# Altium schematic sheet DecadeBox_1.SchDoc: RESISTOR DECADE BOX
size Letter; SheetNumber: 1; SheetTotal: 2
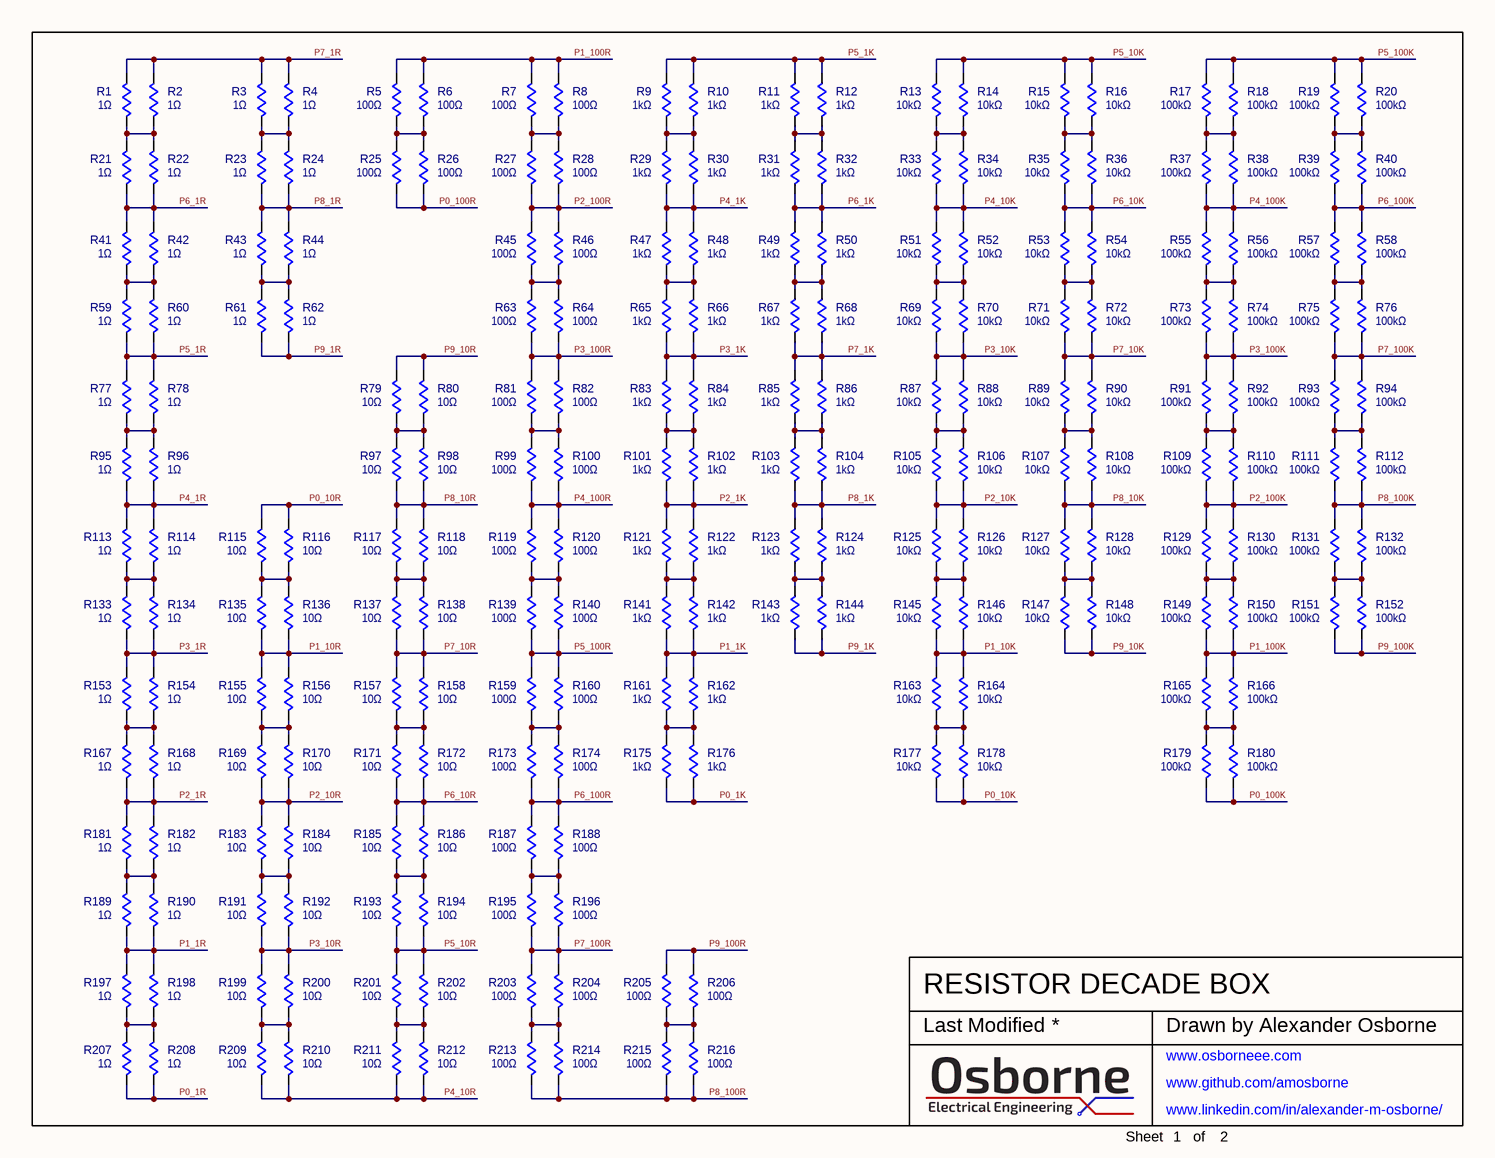
[diagram p0: DecadeBox_1.SchDoc]

## Parts
R1  value 1Ω  [MRS25]  (hidden comment: BC3963CT-ND)
R2  value 1Ω  [MRS25]  (hidden comment: BC3963CT-ND)
R3  value 1Ω  [MRS25]  (hidden comment: BC3963CT-ND)
R4  value 1Ω  [MRS25]  (hidden comment: BC3963CT-ND)
R5  value 100Ω  [MRS25]  (hidden comment: PPC100ZCT-ND)
R6  value 100Ω  [MRS25]  (hidden comment: PPC100ZCT-ND)
R7  value 100Ω  [MRS25]  (hidden comment: PPC100ZCT-ND)
R8  value 100Ω  [MRS25]  (hidden comment: PPC100ZCT-ND)
R9  value 1kΩ  [MRS25]  (hidden comment: PPC1.00KZCT-ND)
R10  value 1kΩ  [MRS25]  (hidden comment: PPC1.00KZCT-ND)
R11  value 1kΩ  [MRS25]  (hidden comment: PPC1.00KZCT-ND)
R12  value 1kΩ  [MRS25]  (hidden comment: PPC1.00KZCT-ND)
R13  value 10kΩ  [MRS25]  (hidden comment: BC3955CT-ND)
R14  value 10kΩ  [MRS25]  (hidden comment: BC3955CT-ND)
R15  value 10kΩ  [MRS25]  (hidden comment: BC3955CT-ND)
R16  value 10kΩ  [MRS25]  (hidden comment: BC3955CT-ND)
R17  value 100kΩ  [MRS25]  (hidden comment: BC3327CT-ND)
R18  value 100kΩ  [MRS25]  (hidden comment: BC3327CT-ND)
R19  value 100kΩ  [MRS25]  (hidden comment: BC3327CT-ND)
R20  value 100kΩ  [MRS25]  (hidden comment: BC3327CT-ND)
R21  value 1Ω  [MRS25]  (hidden comment: BC3963CT-ND)
R22  value 1Ω  [MRS25]  (hidden comment: BC3963CT-ND)
R23  value 1Ω  [MRS25]  (hidden comment: BC3963CT-ND)
R24  value 1Ω  [MRS25]  (hidden comment: BC3963CT-ND)
R25  value 100Ω  [MRS25]  (hidden comment: PPC100ZCT-ND)
R26  value 100Ω  [MRS25]  (hidden comment: PPC100ZCT-ND)
R27  value 100Ω  [MRS25]  (hidden comment: PPC100ZCT-ND)
R28  value 100Ω  [MRS25]  (hidden comment: PPC100ZCT-ND)
R29  value 1kΩ  [MRS25]  (hidden comment: PPC1.00KZCT-ND)
R30  value 1kΩ  [MRS25]  (hidden comment: PPC1.00KZCT-ND)
R31  value 1kΩ  [MRS25]  (hidden comment: PPC1.00KZCT-ND)
R32  value 1kΩ  [MRS25]  (hidden comment: PPC1.00KZCT-ND)
R33  value 10kΩ  [MRS25]  (hidden comment: BC3955CT-ND)
R34  value 10kΩ  [MRS25]  (hidden comment: BC3955CT-ND)
R35  value 10kΩ  [MRS25]  (hidden comment: BC3955CT-ND)
R36  value 10kΩ  [MRS25]  (hidden comment: BC3955CT-ND)
R37  value 100kΩ  [MRS25]  (hidden comment: BC3327CT-ND)
R38  value 100kΩ  [MRS25]  (hidden comment: BC3327CT-ND)
R39  value 100kΩ  [MRS25]  (hidden comment: BC3327CT-ND)
R40  value 100kΩ  [MRS25]  (hidden comment: BC3327CT-ND)
R41  value 1Ω  [MRS25]  (hidden comment: BC3963CT-ND)
R42  value 1Ω  [MRS25]  (hidden comment: BC3963CT-ND)
R43  value 1Ω  [MRS25]  (hidden comment: BC3963CT-ND)
R44  value 1Ω  [MRS25]  (hidden comment: BC3963CT-ND)
R45  value 100Ω  [MRS25]  (hidden comment: PPC100ZCT-ND)
R46  value 100Ω  [MRS25]  (hidden comment: PPC100ZCT-ND)
R47  value 1kΩ  [MRS25]  (hidden comment: PPC1.00KZCT-ND)
R48  value 1kΩ  [MRS25]  (hidden comment: PPC1.00KZCT-ND)
R49  value 1kΩ  [MRS25]  (hidden comment: PPC1.00KZCT-ND)
R50  value 1kΩ  [MRS25]  (hidden comment: PPC1.00KZCT-ND)
R51  value 10kΩ  [MRS25]  (hidden comment: BC3955CT-ND)
R52  value 10kΩ  [MRS25]  (hidden comment: BC3955CT-ND)
R53  value 10kΩ  [MRS25]  (hidden comment: BC3955CT-ND)
R54  value 10kΩ  [MRS25]  (hidden comment: BC3955CT-ND)
R55  value 100kΩ  [MRS25]  (hidden comment: BC3327CT-ND)
R56  value 100kΩ  [MRS25]  (hidden comment: BC3327CT-ND)
R57  value 100kΩ  [MRS25]  (hidden comment: BC3327CT-ND)
R58  value 100kΩ  [MRS25]  (hidden comment: BC3327CT-ND)
R59  value 1Ω  [MRS25]  (hidden comment: BC3963CT-ND)
R60  value 1Ω  [MRS25]  (hidden comment: BC3963CT-ND)
R61  value 1Ω  [MRS25]  (hidden comment: BC3963CT-ND)
R62  value 1Ω  [MRS25]  (hidden comment: BC3963CT-ND)
R63  value 100Ω  [MRS25]  (hidden comment: PPC100ZCT-ND)
R64  value 100Ω  [MRS25]  (hidden comment: PPC100ZCT-ND)
R65  value 1kΩ  [MRS25]  (hidden comment: PPC1.00KZCT-ND)
R66  value 1kΩ  [MRS25]  (hidden comment: PPC1.00KZCT-ND)
R67  value 1kΩ  [MRS25]  (hidden comment: PPC1.00KZCT-ND)
R68  value 1kΩ  [MRS25]  (hidden comment: PPC1.00KZCT-ND)
R69  value 10kΩ  [MRS25]  (hidden comment: BC3955CT-ND)
R70  value 10kΩ  [MRS25]  (hidden comment: BC3955CT-ND)
R71  value 10kΩ  [MRS25]  (hidden comment: BC3955CT-ND)
R72  value 10kΩ  [MRS25]  (hidden comment: BC3955CT-ND)
R73  value 100kΩ  [MRS25]  (hidden comment: BC3327CT-ND)
R74  value 100kΩ  [MRS25]  (hidden comment: BC3327CT-ND)
R75  value 100kΩ  [MRS25]  (hidden comment: BC3327CT-ND)
R76  value 100kΩ  [MRS25]  (hidden comment: BC3327CT-ND)
R77  value 1Ω  [MRS25]  (hidden comment: BC3963CT-ND)
R78  value 1Ω  [MRS25]  (hidden comment: BC3963CT-ND)
R79  value 10Ω  [MRS25]  (hidden comment: PPC10.0ZCT-ND)
R80  value 10Ω  [MRS25]  (hidden comment: PPC10.0ZCT-ND)
R81  value 100Ω  [MRS25]  (hidden comment: PPC100ZCT-ND)
R82  value 100Ω  [MRS25]  (hidden comment: PPC100ZCT-ND)
R83  value 1kΩ  [MRS25]  (hidden comment: PPC1.00KZCT-ND)
R84  value 1kΩ  [MRS25]  (hidden comment: PPC1.00KZCT-ND)
R85  value 1kΩ  [MRS25]  (hidden comment: PPC1.00KZCT-ND)
R86  value 1kΩ  [MRS25]  (hidden comment: PPC1.00KZCT-ND)
R87  value 10kΩ  [MRS25]  (hidden comment: BC3955CT-ND)
R88  value 10kΩ  [MRS25]  (hidden comment: BC3955CT-ND)
R89  value 10kΩ  [MRS25]  (hidden comment: BC3955CT-ND)
R90  value 10kΩ  [MRS25]  (hidden comment: BC3955CT-ND)
R91  value 100kΩ  [MRS25]  (hidden comment: BC3327CT-ND)
R92  value 100kΩ  [MRS25]  (hidden comment: BC3327CT-ND)
R93  value 100kΩ  [MRS25]  (hidden comment: BC3327CT-ND)
R94  value 100kΩ  [MRS25]  (hidden comment: BC3327CT-ND)
R95  value 1Ω  [MRS25]  (hidden comment: BC3963CT-ND)
R96  value 1Ω  [MRS25]  (hidden comment: BC3963CT-ND)
R97  value 10Ω  [MRS25]  (hidden comment: PPC10.0ZCT-ND)
R98  value 10Ω  [MRS25]  (hidden comment: PPC10.0ZCT-ND)
R99  value 100Ω  [MRS25]  (hidden comment: PPC100ZCT-ND)
R100  value 100Ω  [MRS25]  (hidden comment: PPC100ZCT-ND)
R101  value 1kΩ  [MRS25]  (hidden comment: PPC1.00KZCT-ND)
R102  value 1kΩ  [MRS25]  (hidden comment: PPC1.00KZCT-ND)
R103  value 1kΩ  [MRS25]  (hidden comment: PPC1.00KZCT-ND)
R104  value 1kΩ  [MRS25]  (hidden comment: PPC1.00KZCT-ND)
R105  value 10kΩ  [MRS25]  (hidden comment: BC3955CT-ND)
R106  value 10kΩ  [MRS25]  (hidden comment: BC3955CT-ND)
R107  value 10kΩ  [MRS25]  (hidden comment: BC3955CT-ND)
R108  value 10kΩ  [MRS25]  (hidden comment: BC3955CT-ND)
R109  value 100kΩ  [MRS25]  (hidden comment: BC3327CT-ND)
R110  value 100kΩ  [MRS25]  (hidden comment: BC3327CT-ND)
R111  value 100kΩ  [MRS25]  (hidden comment: BC3327CT-ND)
R112  value 100kΩ  [MRS25]  (hidden comment: BC3327CT-ND)
R113  value 1Ω  [MRS25]  (hidden comment: BC3963CT-ND)
R114  value 1Ω  [MRS25]  (hidden comment: BC3963CT-ND)
R115  value 10Ω  [MRS25]  (hidden comment: PPC10.0ZCT-ND)
R116  value 10Ω  [MRS25]  (hidden comment: PPC10.0ZCT-ND)
R117  value 10Ω  [MRS25]  (hidden comment: PPC10.0ZCT-ND)
R118  value 10Ω  [MRS25]  (hidden comment: PPC10.0ZCT-ND)
R119  value 100Ω  [MRS25]  (hidden comment: PPC100ZCT-ND)
R120  value 100Ω  [MRS25]  (hidden comment: PPC100ZCT-ND)
R121  value 1kΩ  [MRS25]  (hidden comment: PPC1.00KZCT-ND)
R122  value 1kΩ  [MRS25]  (hidden comment: PPC1.00KZCT-ND)
R123  value 1kΩ  [MRS25]  (hidden comment: PPC1.00KZCT-ND)
R124  value 1kΩ  [MRS25]  (hidden comment: PPC1.00KZCT-ND)
R125  value 10kΩ  [MRS25]  (hidden comment: BC3955CT-ND)
R126  value 10kΩ  [MRS25]  (hidden comment: BC3955CT-ND)
R127  value 10kΩ  [MRS25]  (hidden comment: BC3955CT-ND)
R128  value 10kΩ  [MRS25]  (hidden comment: BC3955CT-ND)
R129  value 100kΩ  [MRS25]  (hidden comment: BC3327CT-ND)
R130  value 100kΩ  [MRS25]  (hidden comment: BC3327CT-ND)
R131  value 100kΩ  [MRS25]  (hidden comment: BC3327CT-ND)
R132  value 100kΩ  [MRS25]  (hidden comment: BC3327CT-ND)
R133  value 1Ω  [MRS25]  (hidden comment: BC3963CT-ND)
R134  value 1Ω  [MRS25]  (hidden comment: BC3963CT-ND)
R135  value 10Ω  [MRS25]  (hidden comment: PPC10.0ZCT-ND)
R136  value 10Ω  [MRS25]  (hidden comment: PPC10.0ZCT-ND)
R137  value 10Ω  [MRS25]  (hidden comment: PPC10.0ZCT-ND)
R138  value 10Ω  [MRS25]  (hidden comment: PPC10.0ZCT-ND)
R139  value 100Ω  [MRS25]  (hidden comment: PPC100ZCT-ND)
R140  value 100Ω  [MRS25]  (hidden comment: PPC100ZCT-ND)
R141  value 1kΩ  [MRS25]  (hidden comment: PPC1.00KZCT-ND)
R142  value 1kΩ  [MRS25]  (hidden comment: PPC1.00KZCT-ND)
R143  value 1kΩ  [MRS25]  (hidden comment: PPC1.00KZCT-ND)
R144  value 1kΩ  [MRS25]  (hidden comment: PPC1.00KZCT-ND)
R145  value 10kΩ  [MRS25]  (hidden comment: BC3955CT-ND)
R146  value 10kΩ  [MRS25]  (hidden comment: BC3955CT-ND)
R147  value 10kΩ  [MRS25]  (hidden comment: BC3955CT-ND)
R148  value 10kΩ  [MRS25]  (hidden comment: BC3955CT-ND)
R149  value 100kΩ  [MRS25]  (hidden comment: BC3327CT-ND)
R150  value 100kΩ  [MRS25]  (hidden comment: BC3327CT-ND)
R151  value 100kΩ  [MRS25]  (hidden comment: BC3327CT-ND)
R152  value 100kΩ  [MRS25]  (hidden comment: BC3327CT-ND)
R153  value 1Ω  [MRS25]  (hidden comment: BC3963CT-ND)
R154  value 1Ω  [MRS25]  (hidden comment: BC3963CT-ND)
R155  value 10Ω  [MRS25]  (hidden comment: PPC10.0ZCT-ND)
R156  value 10Ω  [MRS25]  (hidden comment: PPC10.0ZCT-ND)
R157  value 10Ω  [MRS25]  (hidden comment: PPC10.0ZCT-ND)
R158  value 10Ω  [MRS25]  (hidden comment: PPC10.0ZCT-ND)
R159  value 100Ω  [MRS25]  (hidden comment: PPC100ZCT-ND)
R160  value 100Ω  [MRS25]  (hidden comment: PPC100ZCT-ND)
R161  value 1kΩ  [MRS25]  (hidden comment: PPC1.00KZCT-ND)
R162  value 1kΩ  [MRS25]  (hidden comment: PPC1.00KZCT-ND)
R163  value 10kΩ  [MRS25]  (hidden comment: BC3955CT-ND)
R164  value 10kΩ  [MRS25]  (hidden comment: BC3955CT-ND)
R165  value 100kΩ  [MRS25]  (hidden comment: BC3327CT-ND)
R166  value 100kΩ  [MRS25]  (hidden comment: BC3327CT-ND)
R167  value 1Ω  [MRS25]  (hidden comment: BC3963CT-ND)
R168  value 1Ω  [MRS25]  (hidden comment: BC3963CT-ND)
R169  value 10Ω  [MRS25]  (hidden comment: PPC10.0ZCT-ND)
R170  value 10Ω  [MRS25]  (hidden comment: PPC10.0ZCT-ND)
R171  value 10Ω  [MRS25]  (hidden comment: PPC10.0ZCT-ND)
R172  value 10Ω  [MRS25]  (hidden comment: PPC10.0ZCT-ND)
R173  value 100Ω  [MRS25]  (hidden comment: PPC100ZCT-ND)
R174  value 100Ω  [MRS25]  (hidden comment: PPC100ZCT-ND)
R175  value 1kΩ  [MRS25]  (hidden comment: PPC1.00KZCT-ND)
R176  value 1kΩ  [MRS25]  (hidden comment: PPC1.00KZCT-ND)
R177  value 10kΩ  [MRS25]  (hidden comment: BC3955CT-ND)
R178  value 10kΩ  [MRS25]  (hidden comment: BC3955CT-ND)
R179  value 100kΩ  [MRS25]  (hidden comment: BC3327CT-ND)
R180  value 100kΩ  [MRS25]  (hidden comment: BC3327CT-ND)
R181  value 1Ω  [MRS25]  (hidden comment: BC3963CT-ND)
R182  value 1Ω  [MRS25]  (hidden comment: BC3963CT-ND)
R183  value 10Ω  [MRS25]  (hidden comment: PPC10.0ZCT-ND)
R184  value 10Ω  [MRS25]  (hidden comment: PPC10.0ZCT-ND)
R185  value 10Ω  [MRS25]  (hidden comment: PPC10.0ZCT-ND)
R186  value 10Ω  [MRS25]  (hidden comment: PPC10.0ZCT-ND)
R187  value 100Ω  [MRS25]  (hidden comment: PPC100ZCT-ND)
R188  value 100Ω  [MRS25]  (hidden comment: PPC100ZCT-ND)
R189  value 1Ω  [MRS25]  (hidden comment: BC3963CT-ND)
R190  value 1Ω  [MRS25]  (hidden comment: BC3963CT-ND)
R191  value 10Ω  [MRS25]  (hidden comment: PPC10.0ZCT-ND)
R192  value 10Ω  [MRS25]  (hidden comment: PPC10.0ZCT-ND)
R193  value 10Ω  [MRS25]  (hidden comment: PPC10.0ZCT-ND)
R194  value 10Ω  [MRS25]  (hidden comment: PPC10.0ZCT-ND)
R195  value 100Ω  [MRS25]  (hidden comment: PPC100ZCT-ND)
R196  value 100Ω  [MRS25]  (hidden comment: PPC100ZCT-ND)
R197  value 1Ω  [MRS25]  (hidden comment: BC3963CT-ND)
R198  value 1Ω  [MRS25]  (hidden comment: BC3963CT-ND)
R199  value 10Ω  [MRS25]  (hidden comment: PPC10.0ZCT-ND)
R200  value 10Ω  [MRS25]  (hidden comment: PPC10.0ZCT-ND)
R201  value 10Ω  [MRS25]  (hidden comment: PPC10.0ZCT-ND)
R202  value 10Ω  [MRS25]  (hidden comment: PPC10.0ZCT-ND)
R203  value 100Ω  [MRS25]  (hidden comment: PPC100ZCT-ND)
R204  value 100Ω  [MRS25]  (hidden comment: PPC100ZCT-ND)
R205  value 100Ω  [MRS25]  (hidden comment: PPC100ZCT-ND)
R206  value 100Ω  [MRS25]  (hidden comment: PPC100ZCT-ND)
R207  value 1Ω  [MRS25]  (hidden comment: BC3963CT-ND)
R208  value 1Ω  [MRS25]  (hidden comment: BC3963CT-ND)
R209  value 10Ω  [MRS25]  (hidden comment: PPC10.0ZCT-ND)
R210  value 10Ω  [MRS25]  (hidden comment: PPC10.0ZCT-ND)
R211  value 10Ω  [MRS25]  (hidden comment: PPC10.0ZCT-ND)
R212  value 10Ω  [MRS25]  (hidden comment: PPC10.0ZCT-ND)
R213  value 100Ω  [MRS25]  (hidden comment: PPC100ZCT-ND)
R214  value 100Ω  [MRS25]  (hidden comment: PPC100ZCT-ND)
R215  value 100Ω  [MRS25]  (hidden comment: PPC100ZCT-ND)
R216  value 100Ω  [MRS25]  (hidden comment: PPC100ZCT-ND)

## Nets
P0_1K: R175.2 R176.2
P0_1R: R207.2 R208.2
P0_10K: R177.2 R178.2
P0_10R: R115.1 R116.1
P0_100K: R179.2 R180.2
P0_100R: R25.2 R26.2
P1_1K: R141.2 R142.2 R161.1 R162.1
P1_1R: R189.2 R190.2 R197.1 R198.1
P1_10K: R145.2 R146.2 R163.1 R164.1
P1_10R: R135.2 R136.2 R155.1 R156.1
P1_100K: R149.2 R150.2 R165.1 R166.1
P1_100R: R5.1 R6.1 R7.1 R8.1
P2_1K: R101.2 R102.2 R121.1 R122.1
P2_1R: R167.2 R168.2 R181.1 R182.1
P2_10K: R105.2 R106.2 R125.1 R126.1
P2_10R: R169.2 R170.2 R183.1 R184.1
P2_100K: R109.2 R110.2 R129.1 R130.1
P2_100R: R27.2 R28.2 R45.1 R46.1
P3_1K: R65.2 R66.2 R83.1 R84.1
P3_1R: R133.2 R134.2 R153.1 R154.1
P3_10K: R69.2 R70.2 R87.1 R88.1
P3_10R: R191.2 R192.2 R199.1 R200.1
P3_100K: R73.2 R74.2 R91.1 R92.1
P3_100R: R63.2 R64.2 R81.1 R82.1
P4_1K: R29.2 R30.2 R47.1 R48.1
P4_1R: R95.2 R96.2 R113.1 R114.1
P4_10K: R33.2 R34.2 R51.1 R52.1
P4_10R: R209.2 R210.2 R211.2 R212.2
P4_100K: R37.2 R38.2 R55.1 R56.1
P4_100R: R99.2 R100.2 R119.1 R120.1
P5_1K: R9.1 R10.1 R11.1 R12.1
P5_1R: R59.2 R60.2 R77.1 R78.1
P5_10K: R13.1 R14.1 R15.1 R16.1
P5_10R: R193.2 R194.2 R201.1 R202.1
P5_100K: R17.1 R18.1 R19.1 R20.1
P5_100R: R139.2 R140.2 R159.1 R160.1
P6_1K: R31.2 R32.2 R49.1 R50.1
P6_1R: R21.2 R22.2 R41.1 R42.1
P6_10K: R35.2 R36.2 R53.1 R54.1
P6_10R: R171.2 R172.2 R185.1 R186.1
P6_100K: R39.2 R40.2 R57.1 R58.1
P6_100R: R173.2 R174.2 R187.1 R188.1
P7_1K: R67.2 R68.2 R85.1 R86.1
P7_1R: R1.1 R2.1 R3.1 R4.1
P7_10K: R71.2 R72.2 R89.1 R90.1
P7_10R: R137.2 R138.2 R157.1 R158.1
P7_100K: R75.2 R76.2 R93.1 R94.1
P7_100R: R195.2 R196.2 R203.1 R204.1
P8_1K: R103.2 R104.2 R123.1 R124.1
P8_1R: R23.2 R24.2 R43.1 R44.1
P8_10K: R107.2 R108.2 R127.1 R128.1
P8_10R: R97.2 R98.2 R117.1 R118.1
P8_100K: R111.2 R112.2 R131.1 R132.1
P8_100R: R213.2 R214.2 R215.2 R216.2
P9_1K: R143.2 R144.2
P9_1R: R61.2 R62.2
P9_10K: R147.2 R148.2
P9_10R: R79.1 R80.1
P9_100K: R151.2 R152.2
P9_100R: R205.1 R206.1
NetR1_2: R1.2 R2.2 R21.1 R22.1
NetR3_2: R3.2 R4.2 R23.1 R24.1
NetR5_2: R5.2 R6.2 R25.1 R26.1
NetR7_2: R7.2 R8.2 R27.1 R28.1
NetR9_2: R9.2 R10.2 R29.1 R30.1
NetR11_2: R11.2 R12.2 R31.1 R32.1
NetR13_2: R13.2 R14.2 R33.1 R34.1
NetR15_2: R15.2 R16.2 R35.1 R36.1
NetR17_2: R17.2 R18.2 R37.1 R38.1
NetR19_2: R19.2 R20.2 R39.1 R40.1
NetR41_2: R41.2 R42.2 R59.1 R60.1
NetR43_2: R43.2 R44.2 R61.1 R62.1
NetR45_2: R45.2 R46.2 R63.1 R64.1
NetR47_2: R47.2 R48.2 R65.1 R66.1
NetR49_2: R49.2 R50.2 R67.1 R68.1
NetR51_2: R51.2 R52.2 R69.1 R70.1
NetR53_2: R53.2 R54.2 R71.1 R72.1
NetR55_2: R55.2 R56.2 R73.1 R74.1
NetR57_2: R57.2 R58.2 R75.1 R76.1
NetR77_2: R77.2 R78.2 R95.1 R96.1
NetR79_2: R79.2 R80.2 R97.1 R98.1
NetR81_2: R81.2 R82.2 R99.1 R100.1
NetR83_2: R83.2 R84.2 R101.1 R102.1
NetR85_2: R85.2 R86.2 R103.1 R104.1
NetR87_2: R87.2 R88.2 R105.1 R106.1
NetR89_2: R89.2 R90.2 R107.1 R108.1
NetR91_2: R91.2 R92.2 R109.1 R110.1
NetR93_2: R93.2 R94.2 R111.1 R112.1
NetR113_2: R113.2 R114.2 R133.1 R134.1
NetR115_2: R115.2 R116.2 R135.1 R136.1
NetR117_2: R117.2 R118.2 R137.1 R138.1
NetR119_2: R119.2 R120.2 R139.1 R140.1
NetR121_2: R121.2 R122.2 R141.1 R142.1
NetR123_2: R123.2 R124.2 R143.1 R144.1
NetR125_2: R125.2 R126.2 R145.1 R146.1
NetR127_2: R127.2 R128.2 R147.1 R148.1
NetR129_2: R129.2 R130.2 R149.1 R150.1
NetR131_2: R131.2 R132.2 R151.1 R152.1
NetR153_2: R153.2 R154.2 R167.1 R168.1
NetR155_2: R155.2 R156.2 R169.1 R170.1
NetR157_2: R157.2 R158.2 R171.1 R172.1
NetR159_2: R159.2 R160.2 R173.1 R174.1
NetR161_2: R161.2 R162.2 R175.1 R176.1
NetR163_2: R163.2 R164.2 R177.1 R178.1
NetR165_2: R165.2 R166.2 R179.1 R180.1
NetR181_2: R181.2 R182.2 R189.1 R190.1
NetR183_2: R183.2 R184.2 R191.1 R192.1
NetR185_2: R185.2 R186.2 R193.1 R194.1
NetR187_2: R187.2 R188.2 R195.1 R196.1
NetR197_2: R197.2 R198.2 R207.1 R208.1
NetR199_2: R199.2 R200.2 R209.1 R210.1
NetR201_2: R201.2 R202.2 R211.1 R212.1
NetR203_2: R203.2 R204.2 R213.1 R214.1
NetR205_2: R205.2 R206.2 R215.1 R216.1

## Notes on the sheet
- Last Modified
- Drawn by Alexander Osborne
- www.osborneee.com <http://www.osborneee.com>
- www.github.com/amosborne <http://www.github.com/amosborne>
- Sheet
- www.linkedin.com/in/alexander-m-osborne/ <http://www.linkedin.com/in/alexander-m-osborne/>
- of

## Library data of the parts
R1-R4 R21-R24 R41-R44 R59-R62 R77 R78 R95 R96 R113 R114 R133 R134 R153 R154 R167 R168 R181 R182 R189 R190 R197 R198 R207 R208 = RES-1OHM: RES 1Ω 1% 50ppm/K 600mW; Tolerance: 1% + 50ppm/K; Supplier 1: Digi-Key; Supplier Part Number 1: BC3963CT-ND; Power: 600mW
R5-R8 R25-R28 R45 R46 R63 R64 R81 R82 R99 R100 R119 R120 R139 R140 R159 R160 R173 R174 R187 R188 R195 R196 R203-R206 R213-R216 = RES-100OHM: RES 100Ω 1% 50ppm/K 600mW; Tolerance: 1% + 50ppm/K; Supplier 1: Digi-Key; Supplier Part Number 1: PPC100ZCT-ND; Power: 600mW
R9-R12 R29-R32 R47-R50 R65-R68 R83-R86 R101-R104 R121-R124 R141-R144 R161 R162 R175 R176 = RES-1KOHM: RES 1kΩ 1% 50ppm/K 600mW; Tolerance: 1% + 50ppm/K; Supplier 1: Digi-Key; Supplier Part Number 1: PPC1.00KZCT-ND; Power: 600mW
R13-R16 R33-R36 R51-R54 R69-R72 R87-R90 R105-R108 R125-R128 R145-R148 R163 R164 R177 R178 = RES-10KOHM: RES 10kΩ 1% 50ppm/K 600mW; Tolerance: 1% + 50ppm/K; Supplier 1: Digi-Key; Supplier Part Number 1: BC3955CT-ND; Power: 600mW
R17-R20 R37-R40 R55-R58 R73-R76 R91-R94 R109-R112 R129-R132 R149-R152 R165 R166 R179 R180 = RES-100KOHM: RES 100kΩ 1% 50ppm/K 600mW; Tolerance: 1% + 50ppm/K; Supplier 1: Digi-Key; Supplier Part Number 1: BC3327CT-ND; Power: 600mW
R79 R80 R97 R98 R115-R118 R135-R138 R155-R158 R169-R172 R183-R186 R191-R194 R199-R202 R209-R212 = RES-10OHM: RES 10Ω 1% 50ppm/K 600mW; Tolerance: 1% + 50ppm/K; Supplier 1: Digi-Key; Supplier Part Number 1: PPC10.0ZCT-ND; Power: 600mW